# Altium schematic sheet Fuente_TP1.SchDoc
size A4
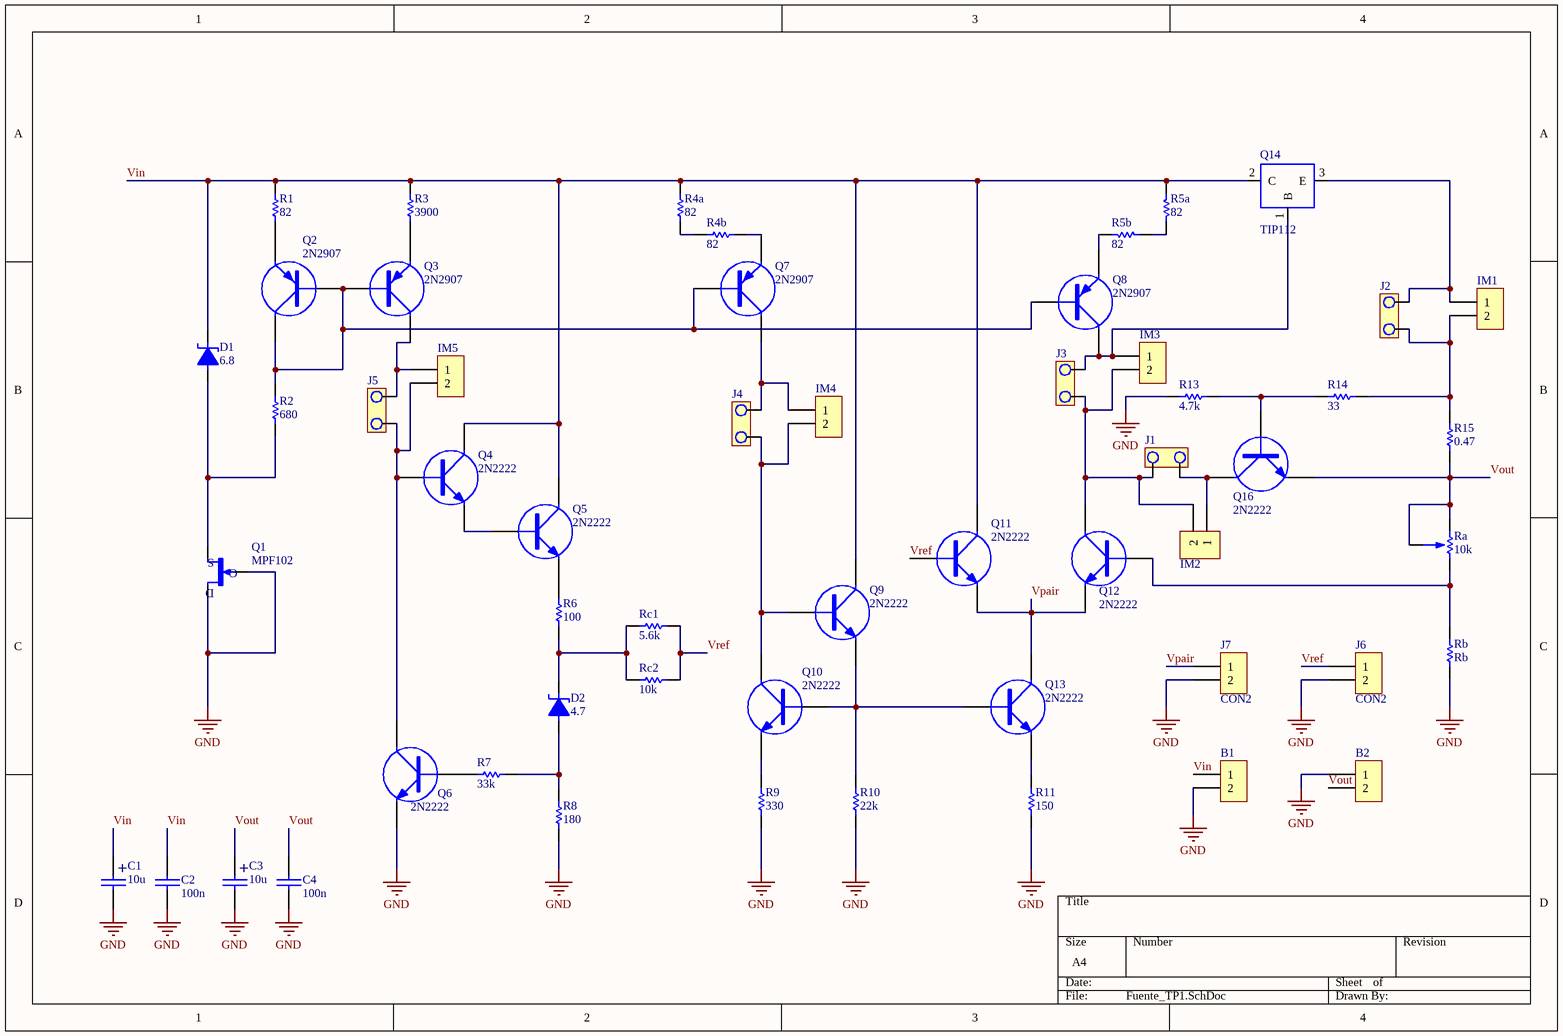
[diagram p0: Fuente_TP1.SchDoc]

## Parts
B1  (no value)  [BORNERA2]
B2  (no value)  [BORNERA2]
C1  10u  [CAP100RP]
C2  100n  [CAP200]
C3  10u  [CAP100RP]
C4  100n  [CAP200]
D1  6.8  [DO41]
D2  4.7  [DO41]
IM1  (no value)  [SIP2]
IM2  (no value)  [SIP2]
IM3  (no value)  [SIP2]
IM4  (no value)  [SIP2]
IM5  (no value)  [SIP2]
J1  (no value)  [JUMPER2]
J2  (no value)  [JUMPER2]
J3  (no value)  [JUMPER2]
J4  (no value)  [JUMPER2]
J5  (no value)  [JUMPER2]
J6  CON2  [SIP2]
J7  CON2  [SIP2]
Q1  MPF102  [TO92]
Q2  2N2907  [TO92]
Q3  2N2907  [TO92]
Q4  2N2222  [TO92]
Q5  2N2222  [TO92]
Q6  2N2222  [TO92]
Q7  2N2907  [TO92]
Q8  2N2907  [TO92]
Q9  2N2222  [TO92]
Q10  2N2222  [TO92]
Q11  2N2222  [TO92]
Q12  2N2222  [TO92]
Q13  2N2222  [TO92]
Q14  TIP112  [TO-220 V]
Q16  2N2222  [TO92]
R1  82  [0805]
R2  680  [0805]
R3  3900  [0805]
R4a  82  [0805]
R4b  82  [0805]
R5a  82  [0805]
R5b  82  [0805]
R6  100  [RES300]
R7  33k  [0805]
R8  180  [RES300]
R9  330  [0805]
R10  22k  [0805]
R11  150  [0805]
R13  4.7k  [0805]
R14  33  [0805]
R15  0.47  [RES600]
Ra  10k  [PRESET V]
Rb  Rb  [0805]
Rc1  5.6k  [0805]
Rc2  10k  [0805]

## Nets
GND: B1.2 B2.1 C1.2 C2.2 C3.2 C4.2 J6.2 J7.2 Q1.1(D) Q1.3(G) Q6.2(E) R8.2 R9.2 R10.2 R11.2 R13.2 Rb.1
Vin: B1.1 C1.1 C2.1 D1.2 Q4.3(C) Q5.3(C) Q9.3(C) Q11.3(C) Q14.2(C) R1.2 R3.2 R4a.1 R5a.1
Vout: B2.2 C3.1 C4.1 Q16.2(E) R15.1 Ra.2 Ra.3
Vpair: J7.1 Q11.2(E) Q12.2(E) Q13.3(C)
Vref: J6.1 Q11.1(B) Rc1.1 Rc2.1
NetD1_1: D1.1 Q1.2(S) R2.1
NetD2_1: D2.1 R7.1 R8.1
NetD2_2: D2.2 R6.1 Rc1.2 Rc2.2
NetIM1_1: IM1.1 J2.1 Q14.3(E)
NetIM1_2: IM1.2 J2.2 R14.1 R15.2
NetIM2_1: IM2.1 J1.1 Q16.3(C)
NetIM2_2: IM2.2 IM3.2 J1.2 J3.2 Q12.3(C)
NetIM3_1: IM3.1 J3.1 Q8.2(C) Q14.1(B)
NetIM4_1: IM4.1 J4.1 Q7.2(C)
NetIM4_2: IM4.2 J4.2 Q9.1(B) Q10.3(C)
NetIM5_1: IM5.1 J5.1 Q3.2(C)
NetIM5_2: IM5.2 J5.2 Q4.1(B) Q6.3(C)
NetQ2_1: Q2.1(B) Q2.2(C) Q3.1(B) Q7.1(B) Q8.1(B) R2.2
NetQ2_3: Q2.3(E) R1.1
NetQ3_3: Q3.3(E) R3.1
NetQ4_2: Q4.2(E) Q5.1(B)
NetQ5_2: Q5.2(E) R6.2
NetQ6_1: Q6.1(B) R7.2
NetQ7_3: Q7.3(E) R4b.1
NetQ8_3: Q8.3(E) R5b.1
NetQ9_2: Q9.2(E) Q10.1(B) Q13.1(B) R10.1
NetQ10_2: Q10.2(E) R9.1
NetQ12_1: Q12.1(B) Ra.1 Rb.2
NetQ13_2: Q13.2(E) R11.1
NetQ16_1: Q16.1(B) R13.1 R14.2
NetR4a_2: R4a.2 R4b.2
NetR5a_2: R5a.2 R5b.2

## Notes on the sheet
- (in symbol CAPPOL) +

## Library data of the parts
B1 B2 = BORNERA 2
C1 C3 = CAPPOL
C2 C4 = CAP
D1 D2 = DIODO ZENER
IM1-IM5 = CON2
J1-J5 = JUMPER
Q1 = MPF102: RF Mosfet N-Channel JFET TO-92-3; MF: ON Semiconductor; Price: None; Availability: Unavailable; Package: TO-226-3 ON Semiconductor; SnapEDA_Link: https://www.snapeda.com/parts/MPF102/ON%20Semiconductor/view-part/4705681/?ref=snap; MP: MPF102; Value: *
Q2 Q3 Q7 Q8 = TRANSISTOR PNP
R1-R3 R4a R4b R5a R5b R6-R11 R13-R15 Rb Rc1 Rc2 = RES
Ra = PRESET
Q14 = TIP112: Package: None; Price: None; Value: *; MP: TIP112; Availability: Unavailable